# Altium project TK502_Frontpanel_LEDs.PrjPcb
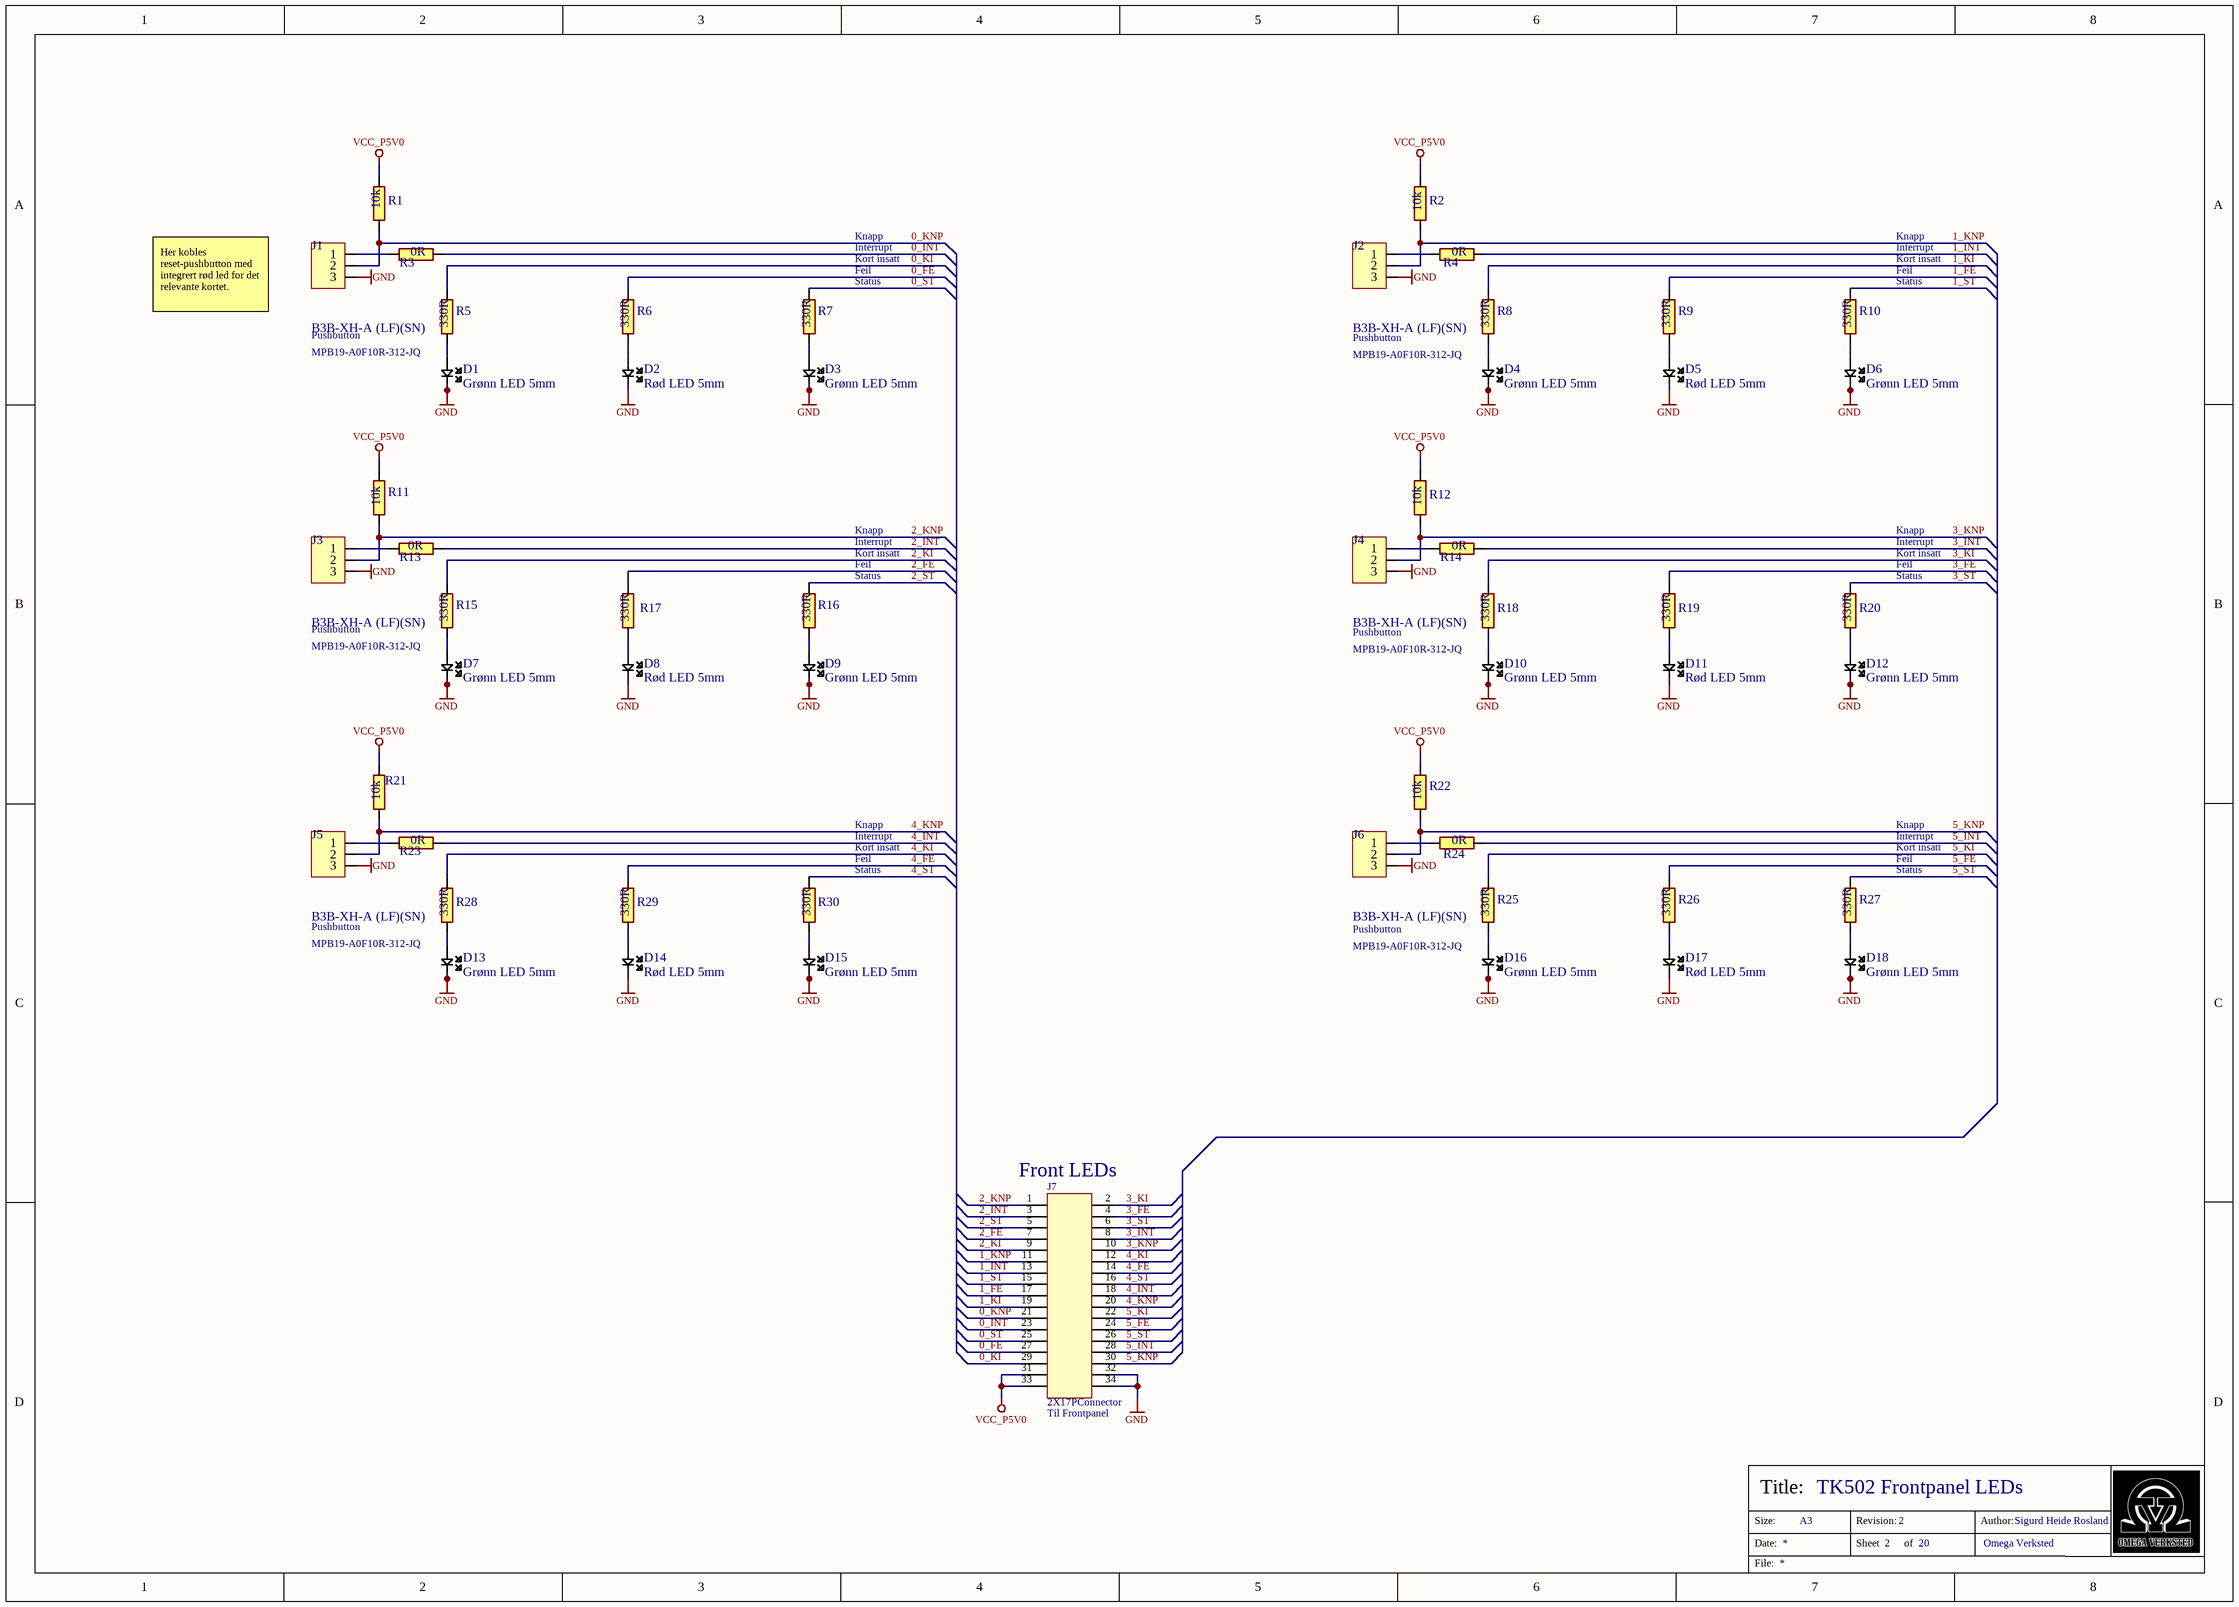
[diagram p0: TK502_Frontpanel_LEDs.SchDoc]
1 sheet, 55 parts. Net scope: global (net labels, ports and power ports of the same name join across sheets).
Board file: TK502_Frontpanel_LEDs.PcbDoc

## Sheet TK502_Frontpanel_LEDs.SchDoc: TK502 Frontpanel LEDs
size A3; Author: Sigurd Heide Rosland; Organization: Omega Verksted; DocumentNumber: 2; Revision: 2; SheetNumber: 2; SheetTotal: 20

### Parts
D1  Grønn LED 5mm  [LED254W7L870D500]
D2  Rød LED 5mm  [LED254W7L870D500]
D3  Grønn LED 5mm  [LED254W7L870D500]
D4  Grønn LED 5mm  [LED254W7L870D500]
D5  Rød LED 5mm  [LED254W7L870D500]
D6  Grønn LED 5mm  [LED254W7L870D500]
D7  Grønn LED 5mm  [LED254W7L870D500]
D8  Rød LED 5mm  [LED254W7L870D500]
D9  Grønn LED 5mm  [LED254W7L870D500]
D10  Grønn LED 5mm  [LED254W7L870D500]
D11  Rød LED 5mm  [LED254W7L870D500]
D12  Grønn LED 5mm  [LED254W7L870D500]
D13  Grønn LED 5mm  [LED254W7L870D500]
D14  Rød LED 5mm  [LED254W7L870D500]
D15  Grønn LED 5mm  [LED254W7L870D500]
D16  Grønn LED 5mm  [LED254W7L870D500]
D17  Rød LED 5mm  [LED254W7L870D500]
D18  Grønn LED 5mm  [LED254W7L870D500]
J1  B3B-XH-A (LF)(SN)  [JST_3P]
J2  B3B-XH-A (LF)(SN)  [JST_3P]
J3  B3B-XH-A (LF)(SN)  [JST_3P]
J4  B3B-XH-A (LF)(SN)  [JST_3P]
J5  B3B-XH-A (LF)(SN)  [JST_3P]
J6  B3B-XH-A (LF)(SN)  [JST_3P]
J7  2X17PConnector  [HDRV34W64P254_2X17_5070X900X900B]
R1  10k  [RESC0603(1608)_N]
R2  10k  [RESC0603(1608)_N]
R3  0R  [RESC0603(1608)_N]
R4  0R  [RESC0603(1608)_N]
R5  330R  [RESC0603(1608)_N]
R6  330R  [RESC0603(1608)_N]
R7  330R  [RESC0603(1608)_N]
R8  330R  [RESC0603(1608)_N]
R9  330R  [RESC0603(1608)_N]
R10  330R  [RESC0603(1608)_N]
R11  10k  [RESC0603(1608)_N]
R12  10k  [RESC0603(1608)_N]
R13  0R  [RESC0603(1608)_N]
R14  0R  [RESC0603(1608)_N]
R15  330R  [RESC0603(1608)_N]
R16  330R  [RESC0603(1608)_N]
R17  330R  [RESC0603(1608)_N]
R18  330R  [RESC0603(1608)_N]
R19  330R  [RESC0603(1608)_N]
R20  330R  [RESC0603(1608)_N]
R21  10k  [RESC0603(1608)_N]
R22  10k  [RESC0603(1608)_N]
R23  0R  [RESC0603(1608)_N]
R24  0R  [RESC0603(1608)_N]
R25  330R  [RESC0603(1608)_N]
R26  330R  [RESC0603(1608)_N]
R27  330R  [RESC0603(1608)_N]
R28  330R  [RESC0603(1608)_N]
R29  330R  [RESC0603(1608)_N]
R30  330R  [RESC0603(1608)_N]

### Nets
GND: D1.2 D2.2 D3.2 D4.2 D5.2 D6.2 D7.2 D8.2 D9.2 D10.2 D11.2 D12.2 D13.2 D14.2 D15.2 D16.2 D17.2 D18.2 J1.3 J2.3 J3.3 J4.3 J5.3 J6.3 J7.32 J7.34
VCC_P5V0: J7.31 J7.33 R1.2 R2.2 R11.2 R12.2 R21.2 R22.2
0_FE: J7.27 R6.2
0_INT: J7.23 R3.1
0_KI: J7.29 R5.2
0_KNP: J1.2 J7.21 R1.1
0_ST: J7.25 R7.2
1_FE: J7.17 R9.2
1_INT: J7.13 R4.1
1_KI: J7.19 R8.2
1_KNP: J2.2 J7.11 R2.1
1_ST: J7.15 R10.2
2_FE: J7.7 R17.2
2_INT: J7.3 R13.1
2_KI: J7.9 R15.2
2_KNP: J3.2 J7.1 R11.1
2_ST: J7.5 R16.2
3_FE: J7.4 R19.2
3_INT: J7.8 R14.1
3_KI: J7.2 R18.2
3_KNP: J4.2 J7.10 R12.1
3_ST: J7.6 R20.2
4_FE: J7.14 R29.2
4_INT: J7.18 R23.1
4_KI: J7.12 R28.2
4_KNP: J5.2 J7.20 R21.1
4_ST: J7.16 R30.2
5_FE: J7.24 R26.2
5_INT: J7.28 R24.1
5_KI: J7.22 R25.2
5_KNP: J6.2 J7.30 R22.1
5_ST: J7.26 R27.2
NetD1_1: D1.1 R5.1
NetD2_1: D2.1 R6.1
NetD3_1: D3.1 R7.1
NetD4_1: D4.1 R8.1
NetD5_1: D5.1 R9.1
NetD6_1: D6.1 R10.1
NetD7_1: D7.1 R15.1
NetD8_1: D8.1 R17.1
NetD9_1: D9.1 R16.1
NetD10_1: D10.1 R18.1
NetD11_1: D11.1 R19.1
NetD12_1: D12.1 R20.1
NetD13_1: D13.1 R28.1
NetD14_1: D14.1 R29.1
NetD15_1: D15.1 R30.1
NetD16_1: D16.1 R25.1
NetD17_1: D17.1 R26.1
NetD18_1: D18.1 R27.1
NetJ1_1: J1.1 R3.2
NetJ2_1: J2.1 R4.2
NetJ3_1: J3.1 R13.2
NetJ4_1: J4.1 R14.2
NetJ5_1: J5.1 R23.2
NetJ6_1: J6.1 R24.2

### Notes on the sheet
- (near R7) Kort insatt
- Interrupt
- Knapp
- (near R10) Kort insatt
- Her kobles reset-pushbutton med integrert rød led for det relevante kortet.
- Pushbutton
- (near R7) Feil
- (near R7) Status
- (near R10) Feil
- (near R10) Status
- MPB19-A0F10R-312-JQ
- (near R16) Kort insatt
- (near R16) Feil
- (near R16) Status
- (near R20) Kort insatt
- (near R20) Feil
- (near R20) Status
- (near R30) Kort insatt
- (near R30) Feil
- (near R30) Status
- (near R27) Kort insatt
- (near R27) Feil
- (near R27) Status
- (near J7) Front LEDs
- (near J7) Til Frontpanel
- Size:
- Date:
- Title:
- A3
- Revision:
- Sheet
- of
- Author:
- File:

### Library data of the parts
D1 D3 D4 D6 D7 D9 D10 D12 D13 D15 D16 D18 = 5138: LED, Green, 5mm, 572 nm, 2.1 V, 20 mA, 150 mcd; id: 5138; pakke_opprettet_av: 1366; symbol_opprettet_av: 815; leverandor_varenr: 2112108; pris: 3; nokkelord: diode, led, lys, green; produsent: Multicomp; leverandor: Farnell; pakketype: TH; komponenttype: 9; pakke_opprettet: 09/02/2016 18:21:00; symbol_opprettet: 06/07/2014 18:59:47; navn: Grønn LED 5mm
D2 D5 D8 D11 D14 D17 = 5305: LED, Red, 5mm, 643 nm, 1.8 V, 20 mA, 400 mcd; id: 5305; pakke_opprettet_av: 1366; symbol_opprettet_av: 815; leverandor_varenr: 2112111; pris: 3; produsent: Multicomp; leverandor: Farnell; pakketype: TH; rad: 6; rom: OV; lager_type: Fremlager; hylle: 4; antall: 154; komponenttype: 9; pakke_opprettet: 09/02/2016 18:21:00; symbol_opprettet: 06/07/2014 18:59:47; navn: Rød LED 5mm; dybde: 3
J1-J6 = 4473: JST 3pin (pris pr. stk.); id: 4473; pakke_opprettet_av: 815; pris: 2; nokkelord: Connector, Kontakt; pakketype: TH; rad: 3; rom: OV; lager_type: Fremlager; dybde: 0; hylle: 6; antall: 100; leverandor_varenr: 1516277; leverandor: Farnell; komponenttype: 11; pakke_opprettet: 28/06/2014 18:25:12; symbol_opprettet_av: 815; symbol_opprettet: 28/06/2014 15:33:24; navn: B3B-XH-A (LF)(SN); produsent: JST
J7 = 3259: Header; id: 3259; pakke_opprettet_av: 815; leverandor_varenr: 2215313; navn: Header 2X17 Shrouded; pris: 10; nokkelord: IDE; produsent: Amphenol; leverandor: Farnell; pakketype: TH; komponenttype: 11; pakke_opprettet: 12/07/2014 17:05:20; symbol_opprettet_av: 815; symbol_opprettet: 12/07/2014 17:03:56
R1 R2 R11 R12 R21 R22 = 5264: 0.1W 1% Thick film resistor; id: 5264; rad: 0; rom: OV; lager_type: Fremlager; dybde: 72; hylle: 2; antall: 4; pakke_opprettet_av: 815; nokkelord: Resistor Motstand; pakketype: 0603; leverandor_varenr: 2447230; produsent: Multicomp; leverandor: Farnell; komponenttype: 1; pakke_opprettet: 08/07/2014 21:15:30; symbol_opprettet_av: 815; symbol_opprettet: 08/07/2014 21:16:33; navn: 10k; pris: 0
R3 R4 R13 R14 R23 R24 = 3646: 0.1W 1% Thick film resistor, Jumper; id: 3646; pakke_opprettet_av: 815; pris: 0; nokkelord: smd, 0603, motstand; pakketype: 0603; produsent: multicomp; rad: -1; rom: OV; lager_type: Fremlager; hylle: 2; antall: 450; leverandor_varenr: 2447060; leverandor: Farnell; komponenttype: 1; pakke_opprettet: 08/07/2014 21:15:30; symbol_opprettet_av: 815; symbol_opprettet: 08/07/2014 21:16:33; navn: 0R; dybde: 0
R5-R10 R15-R20 R25-R30 = 5343: 0.1W 1% Thick film resistor; id: 5343; rad: 0; rom: OV; lager_type: Fremlager; dybde: 36; hylle: 2; antall: 45; pakke_opprettet_av: 815; nokkelord: Resistor Motstand; pakketype: 0603; leverandor_varenr: 2447339; produsent: Multicomp; leverandor: Farnell; komponenttype: 1; pakke_opprettet: 08/07/2014 21:15:30; symbol_opprettet_av: 815; symbol_opprettet: 08/07/2014 21:16:33; navn: 330R; pris: 0